# EAGLE design C64_PSU_Combi (EAGLE 9.5.2)
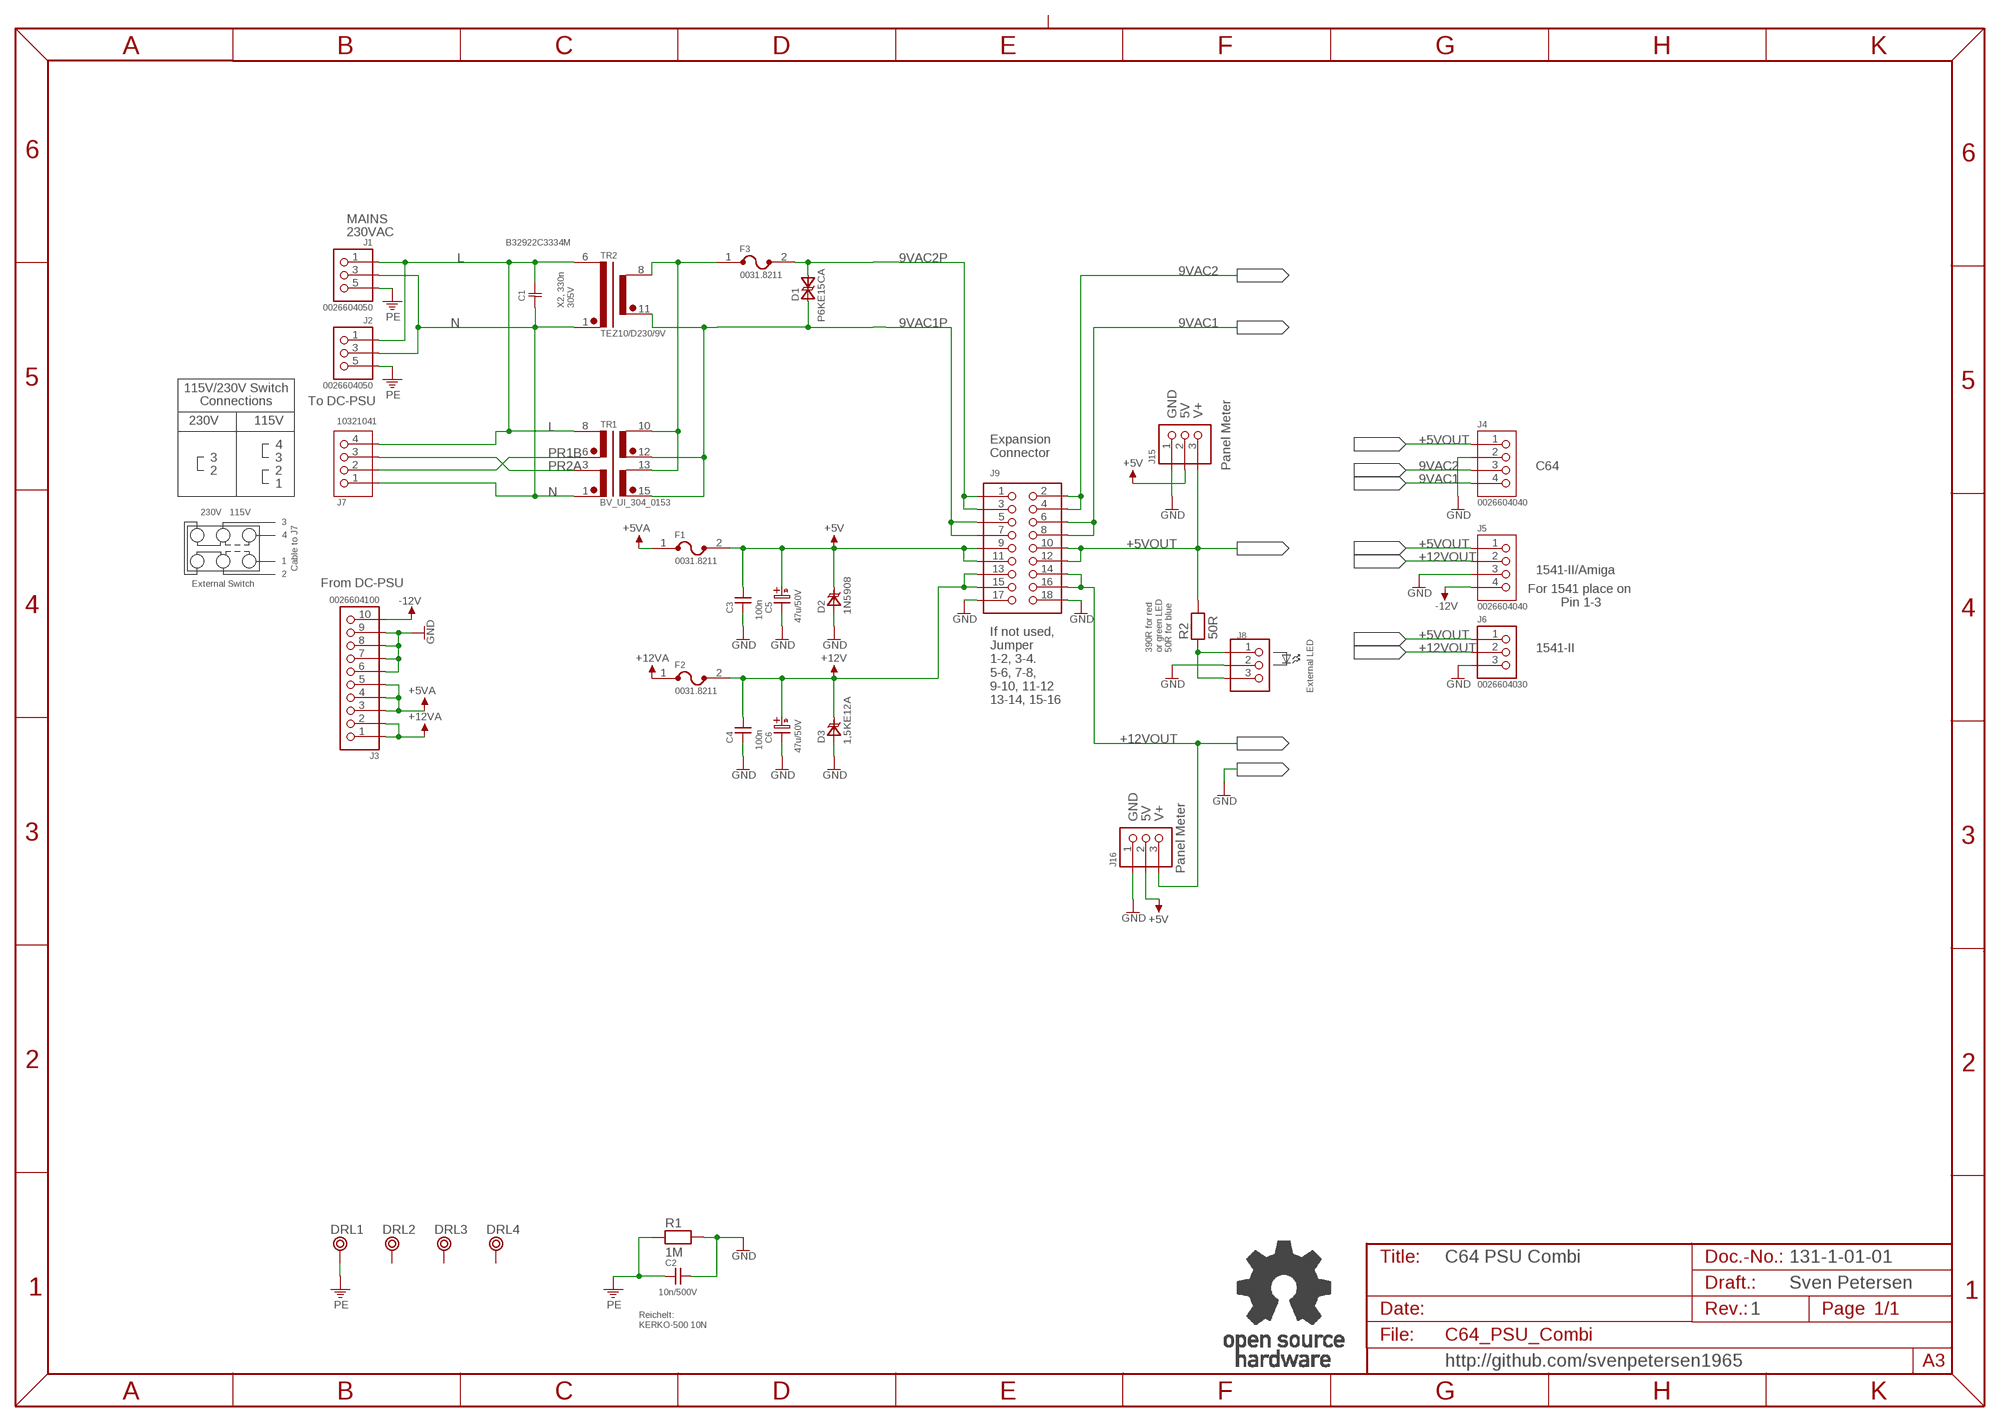
[diagram p0: schematic, sheet 1]

## Parts
C1  B32922C3334M  X2--RM15-18X8  [C-18X8-RM15]
C2  10n/500V  CAP02  [C-5]
C3  100n  CAP01  [C-2,5]
C4  100n  CAP01  [C-2,5]
C5  47u/50V  C07/2,5  [C07/2,5]
C6  47u/50V  C07/2,5  [C07/2,5]
D1  P6KE15CA  [CB417NP]
D2  1N5908  [CB429]
D3  1,5KE12A  [DO-201]
DRL1  BOHR3,5OR  [BOHR3,5_OHNE_RESTRICT]
DRL2  BOHR3,5  [BOHR3,5]
DRL3  BOHR3,5  [BOHR3,5]
DRL4  BOHR3,5  [BOHR3,5]
F1  0031.8211  [0031.8211]
F2  0031.8211  [0031.8211]
F3  0031.8211  [0031.8211]
J1  0026604050  0026604050MOD  [SPOX_3.96_5P3]
J2  0026604050  0026604050MOD  [SPOX_3.96_5P3]
J3  0026604100  [SPOX_3.96_10P]
J4  0026604040  [SPOX_3.96_4P]
J5  0026604040  [SPOX_3.96_4P]
J6  0026604030  [SPOX_3.96_3P]
J7  10321041  [SPOX_5.08_4P]
J8  PINHD-1X3  [1X03]
J9  PINHD-2X9  [2X09]
J15  6410-3P  [6410-3P]
J16  6410-3P  [6410-3P]
R1  1M  RES04  [R-10]
R2  50R  RES04  [R-10]
TR1  BV_UI_304_0153  [UI30]
TR2  TEZ10/D230/9V  [TEZ10]
U$31  OPEN_SOURCE_HW  [OPENHW]

## Nets
9VAC1: J4.4 J9.6 J9.8
9VAC1P: D1.A(A1) J9.5 J9.7 TR1.12(SEC1B) TR1.15(SEC2B) TR2.11(SEC12)
9VAC2: J4.3 J9.2 J9.4
9VAC2F: F3.1 TR1.10(SEC1A) TR1.13(SEC2A) TR2.8(SEC11)
9VAC2P: D1.K(A2) F3.2 J9.1 J9.3
+5V: C3.2 C5.A(+) D2.K F1.2 J9.9 J9.11 J15.2 J16.2
+5VA: F1.1 J3.3 J3.4 J3.5
+5VOUT: J4.1 J5.1 J6.1 J9.10 J9.12 J15.3 R2.2
+12V: C4.2 C6.A(+) D3.K F2.2 J9.13 J9.15
+12VA: F2.1 J3.1 J3.2
+12VOUT: J5.2 J6.2 J9.14 J9.16 J16.3
-12V: J3.10 J5.4
GND: C2.2 C3.1 C4.1 C5.K(-) C6.K(-) D2.A D3.A J3.6 J3.7 J3.8 J3.9 J4.2 J5.3 J6.3 J8.2 J9.17 J9.18 J15.1 J16.1 R1.2
L [mains]: C1.2 J1.1 J2.1 J7.4 TR1.8(PRI1A) TR2.6(PRI1)
N [mains]: C1.1 J1.3 J2.3 J7.1 TR1.1(PRI2B) TR2.1(PRI2)
N$2: J8.1 J8.3 R2.1
PE [PE]: C2.1 DRL1.P$1 J1.5 J2.5 R1.1
PR1B [115V]: J7.2 TR1.6(PRI1B)
PR2A [115V]: J7.3 TR1.3(PRI2A)
Unconnected: DRL2.P$1 DRL3.P$1 DRL4.P$1

## Notes on the sheet
- MAINS
- 230VAC
- X2, 330n
  305V
- 115V/230V Switch
- Connections | To DC-PSU
- GND | 5V | V+
- 230V | 115V
- 4
- 3 | 3
- Expansion
  Connector
- 2 | 2 | Panel Meter | C64
- 1
- 230V | 115V
- 3
- 4
- Cable to J7
- 1
- 2 | 1541-II/Amiga
- External Switch
- From DC-PSU
- For 1541 place on 
  Pin 1-3
- 390R for red
  or green LED
  50R for blue
- 1541-II
- External LED
- If not used,
  Jumper
  1-2, 3-4.
  5-6, 7-8,
  9-10, 11-12
  13-14, 15-16
- GND | 5V | V+
- Panel Meter
- C64 PSU Combi | 131-1-01-01
- Sven Petersen
- 1
- Reichelt:
  KERKO-500 10N
- http://github.com/svenpetersen1965

## Library data of the parts
C1 = Epcos_EMV:X2-*: X2-Kondensatoren
C2 = DISCRETE:CAP02
C3 C4 = DISCRETE:CAP01
C5 C6 = ELCO:C07/2,5
D1 = ST:P6KE15CA
D2 = ST:1N5908
D3 = ST:1,5KE12A
DRL1-DRL4 = Mech_Bohr:BOHR3,5
F1-F3 = Schurter:0031.8211
J1 J2 = MOLEX:0026604050MOD
J3 = MOLEX:0026604100
J4 J5 = MOLEX:0026604040
J6 = MOLEX:0026604030
J7 = MOLEX:10321041
J8 = PINHEAD:PINHD-1X3
J9 = PINHEAD:PINHD-2X9
J15 J16 = MOLEX:6410-3P: 6410/22-27-2031
R1 R2 = DISCRETE:RES04
TR1 = Hahn:BV_UI_304_0153
TR2 = Breve Tufvassons:TEZ10/D230/9V: tme.eu: TEZ10/D/9V
U$31 = Logo:OPEN_SOURCE_HW

## Net classes
1 mains: width 1.016 mm, drill 0.6 mm, clearance 5 mm to class 0, clearance 5 mm
2 PE: width 1.016 mm, drill 0.6 mm, clearance 1.5 mm to class 0, clearance 5 mm to class 1
3 115V: width 1.016 mm, drill 0.6 mm, clearance 2.5 mm to class 0, clearance 2.3 mm to class 1, clearance 5 mm to class 2, clearance 2.3 mm

## Board
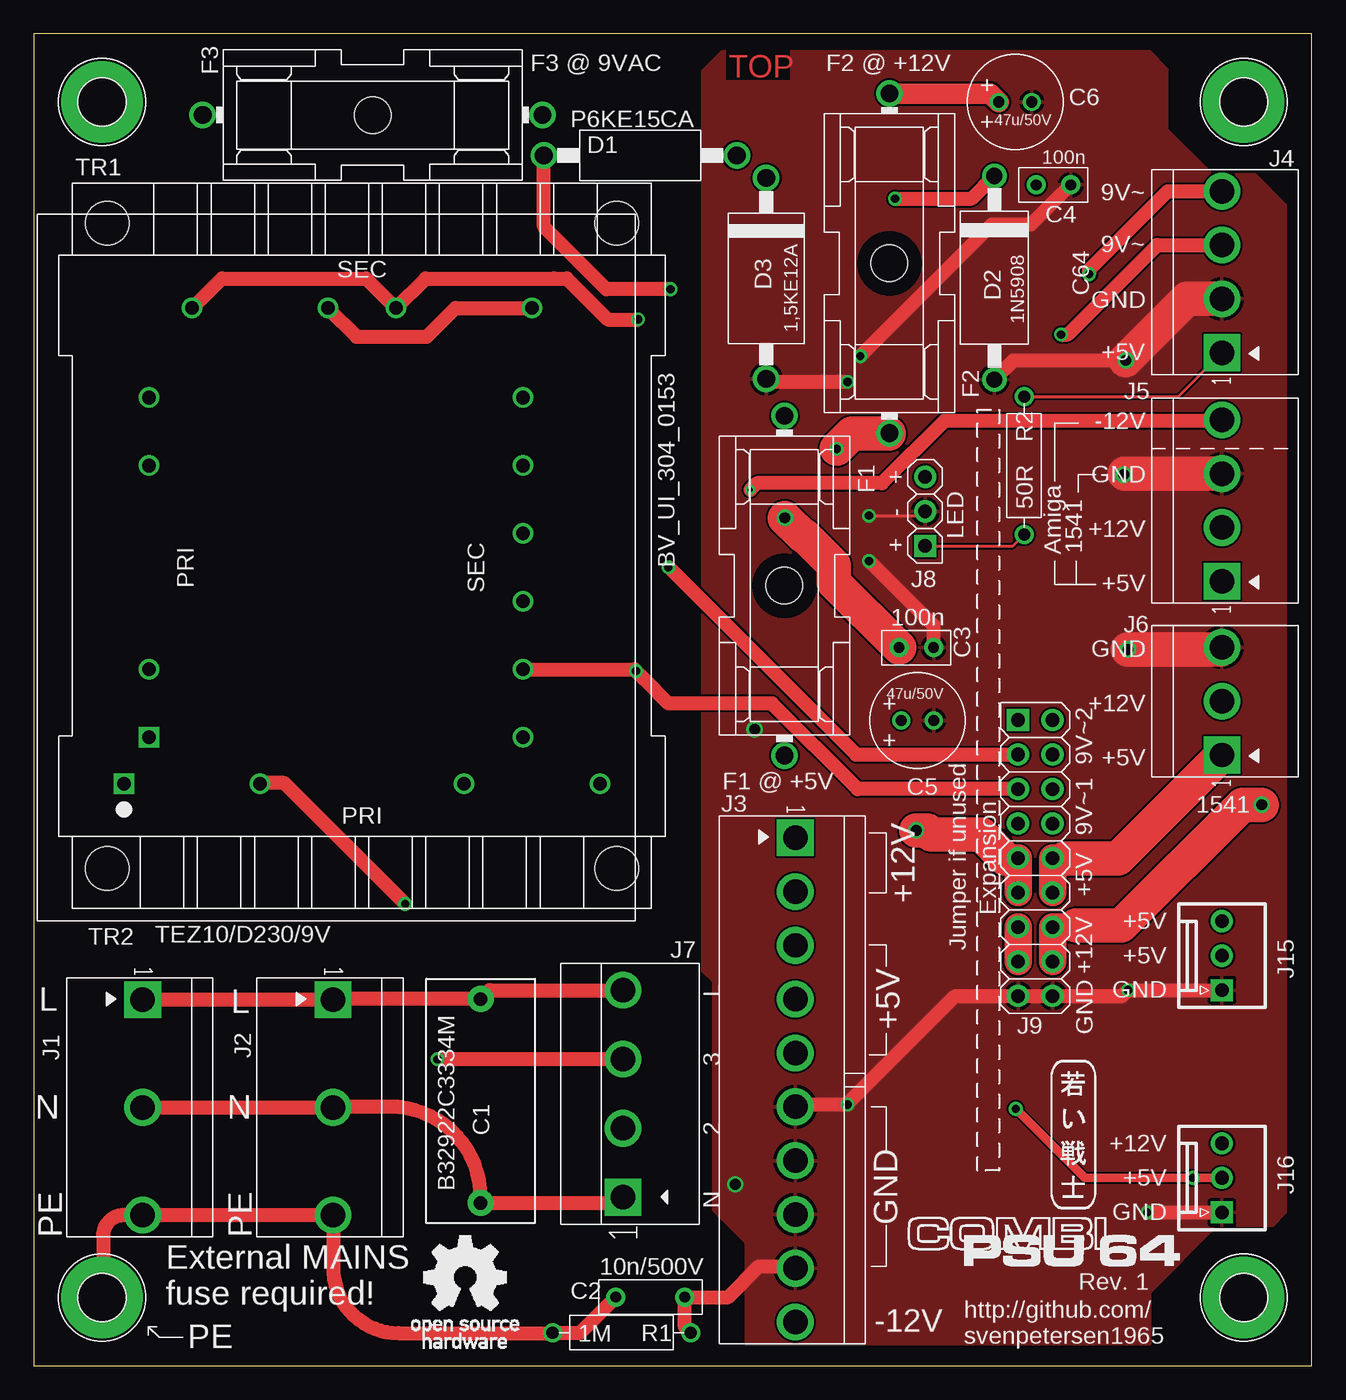
[diagram p1: board, top side]
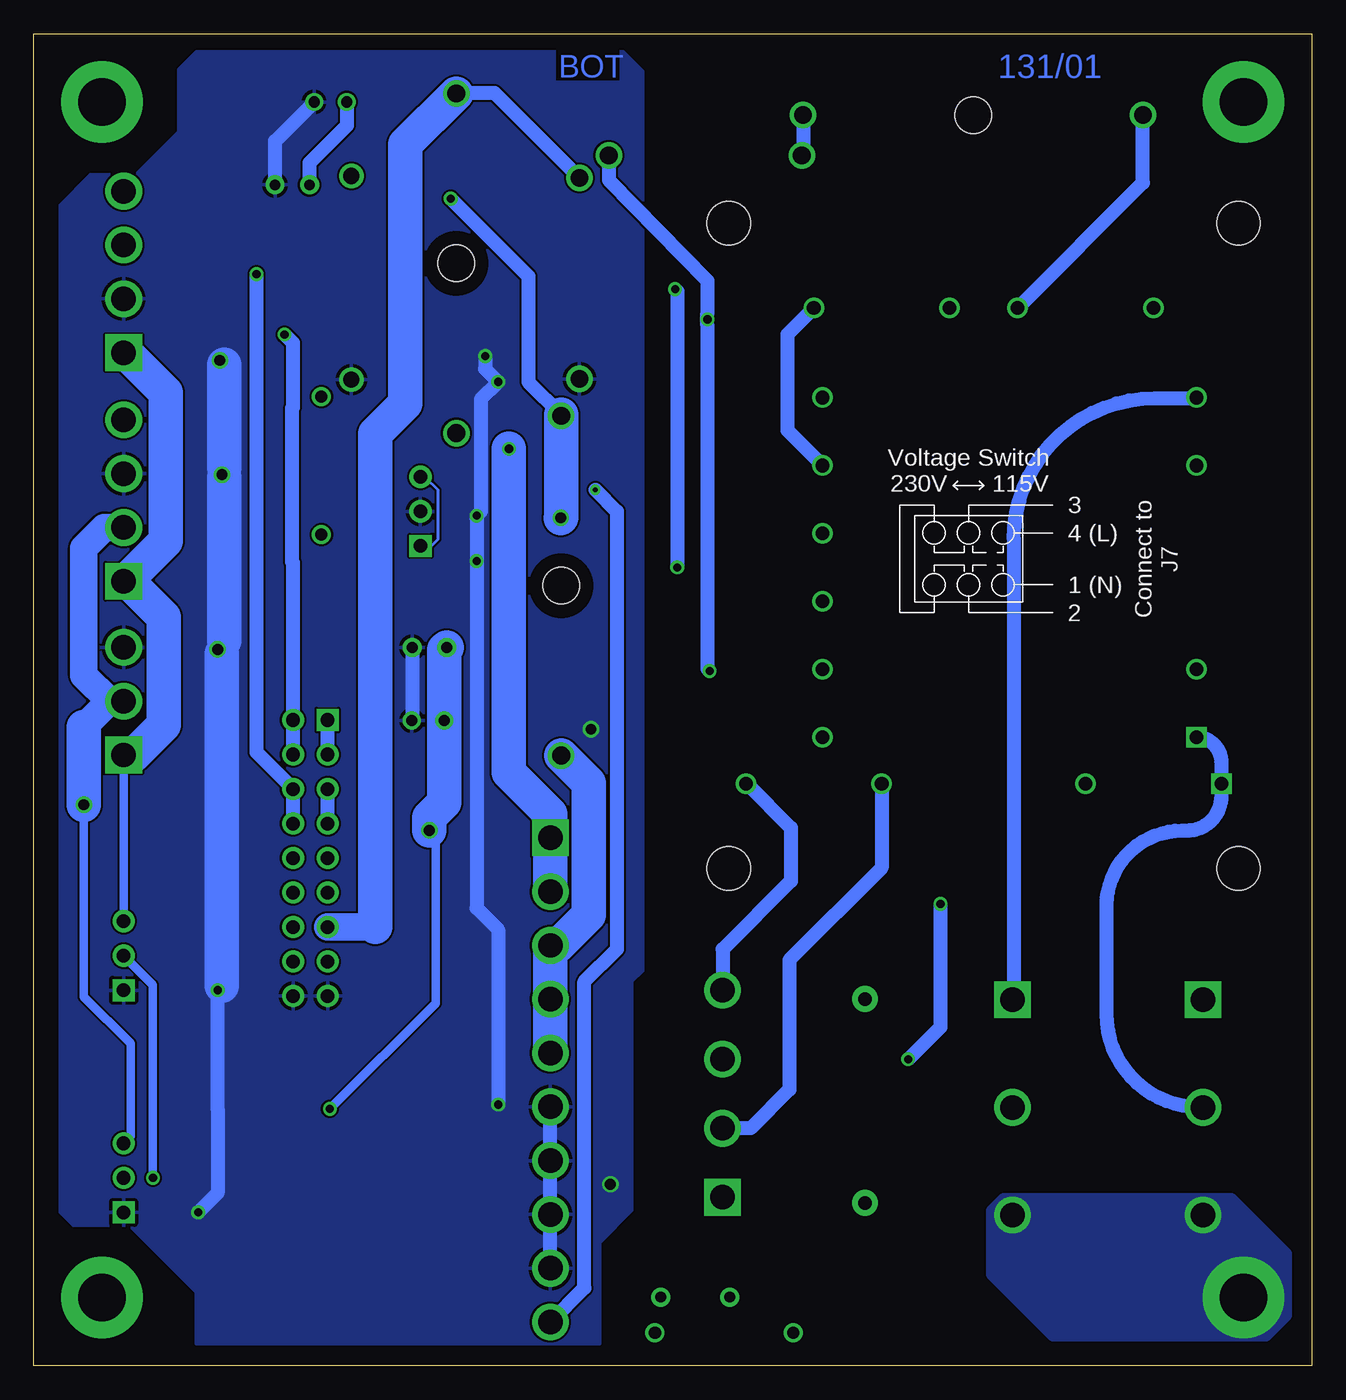
[diagram p2: board, bottom side, seen from below]

Size 94 x 98 mm. Coordinates in mm from the lower left corner, seen from the top.
Outline: 0,0 94,0 94,98 0,98 0,0
Copper layers (1*16): Top 0.035mm / dielectric 1.5mm / Bottom 0.035mm
Design rules "default *": minimum track width 6mil, minimum drill 0.35mm, track to track 6mil, track to pad 6mil, pad to pad 6mil, via to via 6mil, smd to smd 6mil, copper to edge 40mil, drill to drill 6mil, minimum pad ring 10mil, minimum via ring 8mil, stop-mask expansion 4mil, vias tented up to drill 25mil, thermal gap 10mil

### Footprints (pad centres in the part's own frame; a part is rotated, then mirrored left to right if it is on the bottom)
C-18X8-RM15 = drill 1 pad 1.905: 1 -7.5,0; 2 7.5,0
C-5 = drill 0.8 pad 1.397: 1 -2.54,0; 2 2.54,0
C-2,5 = drill 0.8 pad 1.397: 1 -1.27,0; 2 1.27,0
C07/2,5 = drill 0.813 pad 1.27: A -1.202,0; K 1.202,0
CB417NP = drill 1.3: A -7.1,0; K 7.1,0
CB429 = drill 1.2: A -7.5,0; K 7.5,0
DO-201 = drill 1.3: A -7.4,0; K 7.4,0
BOHR3,5_OHNE_RESTRICT = drill 3.5 pad 6: P$1 0,0
BOHR3,5 = drill 3.5 pad 6: P$1 0,0
0031.8211 = drill 1.3: 1 -12.5,0; 2 12.5,0 | hole 2.7: 0,0
SPOX_3.96_5P3 = drill 1.8 square: 1 -7.92,0 | drill 1.8: 3 0,0; 5 7.92,0
SPOX_3.96_10P = drill 1.8 square: 1 -17.82,0 | drill 1.8: 2 -13.86,0; 3 -9.9,0; 4 -5.94,0; 5 -1.98,0; 6 1.98,0; 7 5.94,0; 8 9.9,0; 9 13.86,0; 10 17.82,0
SPOX_3.96_4P = drill 1.8 square: 1 -5.94,0 | drill 1.8: 2 -1.98,0; 3 1.98,0; 4 5.94,0
SPOX_3.96_3P = drill 1.8 square: 1 -3.96,0 | drill 1.8: 2 0,0; 3 3.96,0
SPOX_5.08_4P = drill 1.8 square: 1 -7.62,0 | drill 1.8: 2 -2.54,0; 3 2.54,0; 4 7.62,0
1X03 = drill 1 pad 1.626 square: 1 -2.54,0 | drill 1 pad 1.626: 2 0,0; 3 2.54,0
2X09 = drill 1 pad 1.626 square: 1 -10.16,-1.27 | drill 1 pad 1.626: 2 -10.16,1.27; 3 -7.62,-1.27; 4 -7.62,1.27; 5 -5.08,-1.27; 6 -5.08,1.27; 7 -2.54,-1.27; 8 -2.54,1.27; 9 0,-1.27; 10 0,1.27; 11 2.54,-1.27; 12 2.54,1.27; 13 5.08,-1.27; 14 5.08,1.27; 15 7.62,-1.27; 16 7.62,1.27; 17 10.16,-1.27; 18 10.16,1.27
6410-3P = drill 1 pad 1.626 square: 1 -2.54,0 | drill 1 pad 1.626: 2 0,0; 3 2.54,0
R-10 = drill 0.889 pad 1.397: 1 -5.08,0; 2 5.08,0
UI30 = drill 1 square: 1 17.5,17.5 | drill 1: 3 7.5,17.5; 6 -7.5,17.5; 8 -17.5,17.5; 10 -12.5,-17.5; 12 -2.5,-17.5; 13 2.5,-17.5; 15 12.5,-17.5 | hole 3.2: 18.75,-23.75; 18.75,23.75; -18.75,-23.75; -18.75,23.75
TEZ10 = drill 1 square: 1 -12.5,13.75 | drill 1: 2 -7.5,13.75; 5 7.5,13.75; 6 12.5,13.75; 7 12.5,-13.75; 8 7.5,-13.75; 9 2.5,-13.75; 10 -2.5,-13.75; 11 -7.5,-13.75; 12 -12.5,-13.75

### Placement (x,y rotation side)
C1  32.86,19.47 90 top
C2  45.35,5.04 0 top
C3  64.91,52.84 180 top
C4  75,86.89 180 top
C5  65,47.48 0 top
C6  72.19,93 0 top
D1  44.61,89.06 180 top
D2  70.65,80.06 90 top
D3  53.87,80.01 90 top
DRL1  5,5 0 top
DRL2  89,5 0 top
DRL3  89,93 0 top
DRL4  5,93 0 top
F1  55.21,57.39 90 top
F2  62.93,81.12 90 top
F3  24.91,92.03 0 top
J1  8,19 270 top
J2  22,19 270 top
J3  56.01,21.02 270 top
J4  87.4,80.49 90 top
J5  87.4,63.66 90 top
J6  87.4,48.9 90 top
J7  43.34,20 90 top
J8  65.56,62.87 90 top
J9  73.67,37.35 270 top
J15  87.4,30.16 90 top
J16  87.4,13.81 90 top
R1  43.23,2.42 0 top
R2  72.85,66.23 90 top
TR1  24.13,60.33 180 top
TR2  22.23,58.74 90 top
U$31  27.78,1.27 0 top
U$43  [SVEN_TAG]  76.5,17.1 0 top
U$44  [PCB-TITLE/]  -0.16,107.63 0 top  (outside the outline)
U$45  [2LAYER]  51.12,94.77 0 top
U$49  [COMBIPSU64]  64.29,7.3 0 top

### Tracks (layer width: path | path; a pad name or v marks a point on that pad's centre or on a via)
9VAC1  (via drill 0.6)
  Top 1.016: v77.63,80.33 77.63,80.64 83.41,86.43 J4.4
  Bottom 1.016: J9.8 J9.6 77.63,45.12 v77.63,80.33
9VAC1P  (via drill 0.6)
  Top 1.016: v44.29,51.12 44.85,50.56 | 44.85,50.56 46.67,48.74 54.29,48.74 60.6,42.43 J9.5 | TR1.15 13.81,80.01 24.45,80.01 TR1.12 28.82,80.01 38.26,80.01 39.21,80.01 42.23,76.99 v44.45,76.99 | TR2.11 44.17,51.24 44.85,50.56
  Bottom 1.016: v44.29,51.12 44.45,51.28 44.45,76.52 v44.45,76.99 44.45,77.47 44.45,79.83 51.71,87.25 D1.A | J9.7 J9.5
9VAC2  (via drill 0.6)
  Top 1.016: v75.56,75.88 76.04,75.88 82.62,82.47 J4.3
  Bottom 1.016: J9.4 J9.2 74.94,59.1 75,59.16 75,70.45 74.94,70.52 74.94,75.25 v75.56,75.88
9VAC2F
  Top 1.016: TR1.13 23.73,75.72 28.89,75.72 30.99,77.83 TR1.10
  Bottom 1.016: TR1.13 12.41,87.04 F3.1 | TR1.10 38.58,75.88 38.58,68.84 TR2.8
9VAC2P  (via drill 0.6)
  Top 1.016: v46.83,79.22 42.11,79.22 37.51,83.82 D1.K | v46.67,58.74 46.72,58.74 60.49,44.97 J9.3
  Bottom 1.016: F3.2 37.41,89.16 D1.K | v46.83,79.22 46.67,79.06 v46.67,58.74 | J9.3 J9.1
+5V  (via drill 0.6, 0.8)
  Top 0.61: v72.23,18.89 77.31,13.81 v85.25,13.81 J16.2
  Top 1.016: v63.34,85.88 68.97,85.88 D2.K
  Top 2.032: 71.44,37.31 72.35,37.31 J9.9 J9.11
  Top 2.54: v64.91,39.39 65.71,39.39 66.02,39.07 69.67,39.07 71.44,37.31 | C3.2 58.85,57.63 58.85,58.9 56.72,61.03 56.6,61.03 v55.24,62.39
  Bottom 0.61: v64.91,39.39 64.45,38.93 64.45,26.67 v72.23,18.89 | J15.2 85.25,28.01 v85.25,13.81
  Bottom 1.016: v63.34,85.88 57.63,80.17 57.63,72.39 55.21,69.98 F1.2
  Bottom 2.54: C3.2 63.8,52.68 C5.A 63.8,41.45 64.91,40.34 v64.91,39.39 | v55.24,62.39 55.21,62.42 55.21,69.98
+5VA
  Bottom 2.54: J3.5 J3.4 J3.3 55.44,30.92 53.18,33.18 53.18,42.86 F1.1
+5VOUT
  Top 0.203: R2.2 84.17,71.31 J4.1
  Top 2.032: J9.12 J9.10 75.84,37.35 75.88,37.31
  Top 2.54: 75.88,37.31 79.77,37.31 J6.1
  Bottom 0.61: J6.1 J15.3
  Bottom 1.524: J4.1 87.25,74.55 | 87.15,57.78 87.22,57.72 J5.1
  Bottom 2.54: 87.25,74.55 84.3,71.6 84.3,60.66 87.24,57.72 J5.1 | 87.15,57.78 84.45,55.09 84.45,47.15 86.67,44.94 J6.1
+12V
  Top 1.524: F2.2 70.37,93.62 C6.A
  Top 2.032: J9.15 J9.13
  Bottom 1.016: D3.K 60.12,93.66 62.89,93.66 F2.2 | C6.A 70.99,91.31 70.96,91.28 73.74,88.5 73.74,86.9 C4.2
  Bottom 2.032: J9.13 68.9,32.27
  Bottom 2.54: 68.9,32.27 68.9,68.58 66.67,70.8 66.67,89.88 F2.2
+12VA  (via drill 0.6)
  Top 1.524: F2.1 62.89,68.58
  Top 2.54: 62.89,68.58 60.17,68.58 v59.05,67.47
  Bottom 1.016: 56.04,39.21 56.01,39.18 J3.1 56.04,38.87
  Bottom 1.27: 56.04,39.21 56.04,38.87
  Bottom 2.54: J3.2 J3.1 56.01,40.61 59.05,43.66 v59.05,67.47
+12VOUT  (via drill 0.8)
  Top 2.032: J9.16 J9.14 76.56,32.27 76.68,32.38
  Top 2.54: v90.33,41.27 88.9,41.27 80.01,32.38 76.68,32.38
  Bottom 0.61: J16.3 86.89,16.86 86.89,23.71 90.33,27.15 v90.33,41.27
  Bottom 1.016: J6.2 88.42,48.9 J6.2
  Bottom 2.032: 90.33,46.99 88.42,48.9 90.33,50.8 90.33,60.17 88.82,61.68 J5.2
  Bottom 2.54: v90.33,41.27 90.33,46.99
-12V  (via drill 0.35)
  Top 0.61: 87.33,69.53 J5.4
  Top 1.016: 87.33,69.53 66.99,69.53 62.39,64.93 53.18,64.93 v52.7,64.45
  Bottom 1.016: J3.10 53.5,5.71 53.5,28.26 51.12,30.64 51.12,55.72 51.12,62.87 v52.7,64.45
GND  (via drill 0.6, 0.8)
  Top 0.203: v61.44,62.55 65.25,62.55 J8.2
  Top 1.016: J3.6 56.17,19.2 v59.85,19.2 59.85,19.25 67.79,27.19 J9.17 J9.18 80.05,27.19 v80.49,27.62 J15.1 | v59.85,72.39 54.1,72.39 D3.A | C3.1 66.18,54.47 v61.44,59.21 | v60.8,74.3 70.5,83.99 73.37,83.99 C4.1 | 87.29,52.7 J6.3 | D2.A 72.07,73.98 v80.33,73.98 | v80.17,65.56 80.24,65.64 | v81.92,11.27 J16.1 | J3.9 55.87,7.3 53.34,7.3 51.08,5.04 C2.2 47.89,2.84 R1.2
  Top 2.54: v80.49,52.7 87.29,52.7 | v80.33,73.98 84.86,78.51 J4.2 | 80.24,65.64 J5.3
  Bottom 1.016: J3.9 J3.8 J3.7 J3.6 | C3.1 66.18,47.51 C5.K | v60.8,74.3 60.8,73.34 v59.85,72.39 61.12,71.12 61.12,62.87 v61.44,62.55 61.44,62.39 v61.44,59.21 61.44,33.68 59.85,32.09 v59.85,19.2 | 80.17,27.94 v80.49,27.62 80.49,18.89 80.49,12.7 v81.92,11.27 | 80.17,52.39 v80.49,52.7 80.49,52.86 80.01,53.34 | 80.01,65.41 v80.17,65.56 80.17,65.88 80.01,66.04 | 80.01,73.66 v80.33,73.98 | C4.1 76.27,90.12 C6.K
  Bottom 2.54: 80.17,27.94 80.17,52.39 | 80.01,53.34 80.01,65.41 | 80.01,66.04 80.01,73.66
  other vias: 53.02,46.83 51.59,13.34
  pour Bottom: 52.39,1.59 82.07,1.59 82.07,5.4 87,10.32 91.12,10.32 92.08,11.27 92.08,85.41 89.85,87.63 86.52,87.63 83.34,90.81 83.34,95.41 82.07,96.68 50.64,96.68 49.21,95.25 49.21,29.05 50.01,28.26 50.01,11.43 52.39,9.05
  pour Top: 52.39,1.59 82.07,1.59 82.07,5.4 87,10.32 91.12,10.32 92.08,11.27 92.08,85.41 89.85,87.63 86.68,87.63 83.34,90.96 83.34,95.41 82.07,96.68 50.64,96.68 49.21,95.25 49.21,29.05 50.01,28.26 50.01,11.43 52.39,9.05
L
  Top 1.016: J1.1 J2.1 arc-90 22.05,26.97 C1.2 33.51,27.62 J7.4
  Bottom 1.016: J2.1 arc-90 21.91,27.01 21.91,60.8 arc90 11.52,71.19 8.52,71.19 TR2.6 | TR1.8 41.57,42.83 38.31,39.57 38.31,35.66 43.34,30.64 J7.4
N
  Top 1.016: J1.3 J2.3 arc-90 22.05,19.05 26.19,19.05 arc-90 32.86,12.38 C1.1 42.93,11.97 J7.1
  Bottom 1.016: J1.3 8.21,19 arc90 15.08,25.88 15.08,33.81 arc90 9.53,39.37 9.17,39.37 arc-90 6.63,41.91 TR1.1 6.63,44.39 arc-90 TR2.1
N$2
  Top 0.203: J8.1 72.02,60.33 R2.1
  Bottom 0.203: J8.3 65.25,65.41 64.29,64.45 64.29,60.8 64.77,60.33 J8.1
PE
  Top 1.016: DRL1.P$1 arc90 5.08,5.08 5.08,9.53 arc-90 6.63,11.08 J1.5 J2.5 22,7.21 arc90 26.83,2.38 38.12,2.38 R1.1 40.19,2.42 C2.1
  pour Bottom (no thermals): 1.75,8.26 5.87,12.38 22.7,12.38 23.65,11.43 23.65,6.67 19.05,2.06 3.33,2.06 1.75,3.65
PR1B
  Bottom 1.016: TR1.6 31.63,36.63 38.42,29.84 38.42,20.32 41.27,17.46 J7.2
PR2A  (via drill 0.6)
  Top 1.016: J7.3 v29.69,22.54 | v27.3,33.97 18.41,42.86 16.67,42.86 TR1.3
  Bottom 1.016: v29.69,22.54 27.3,24.92 v27.3,33.97

### Text on the board
Bottom: 131/01
tPlace: F3 @ 9VAC | F2 @ +12V | P6KE15CA | 47u/50V | 100n | 9V~ | 9V~ | C64 | GND | 1N5908 | 1,5KE12A | +5V | -12V | GND | + | - | LED | 50R | 1541 | +12V | + | Amiga | BV_UI_304_0153 | +5V | 100n | GND | 47u/50V | +12V | 9V~2 | +5V | F1 @ +5V | 9V~1 | 1541 | +12V | Jumper if unused | Expansion | +5V | +5V | TEZ10/D230/9V | +12V | +5V | L | GND | L | L | +5V | GND | 3 | N | N | 2 | +12V | +5V | B32922C3334M | GND | N | PE | PE | GND | 10n/500V | Rev. 1 | External MAINS / fuse required! | -12V | 1M | http://github.com/ / svenpetersen1965 | PE
bPlace: Voltage Switch | 115V | 230V | 3 | 4 (L) | Connect to / J7 | 1 (N) | 2
tValues: bi- / directional | X2 cap: 330n / 305V | Remove / pin 2 & 4 | Remove / pin 2 & 4
Measures: 4- 3.5
Document: Sven Petersen | 131-2-01-01 | 2020 | 35µm | 2 | 1